# Altium schematic sheet STM32F103最小系统板.SchDoc
size A3
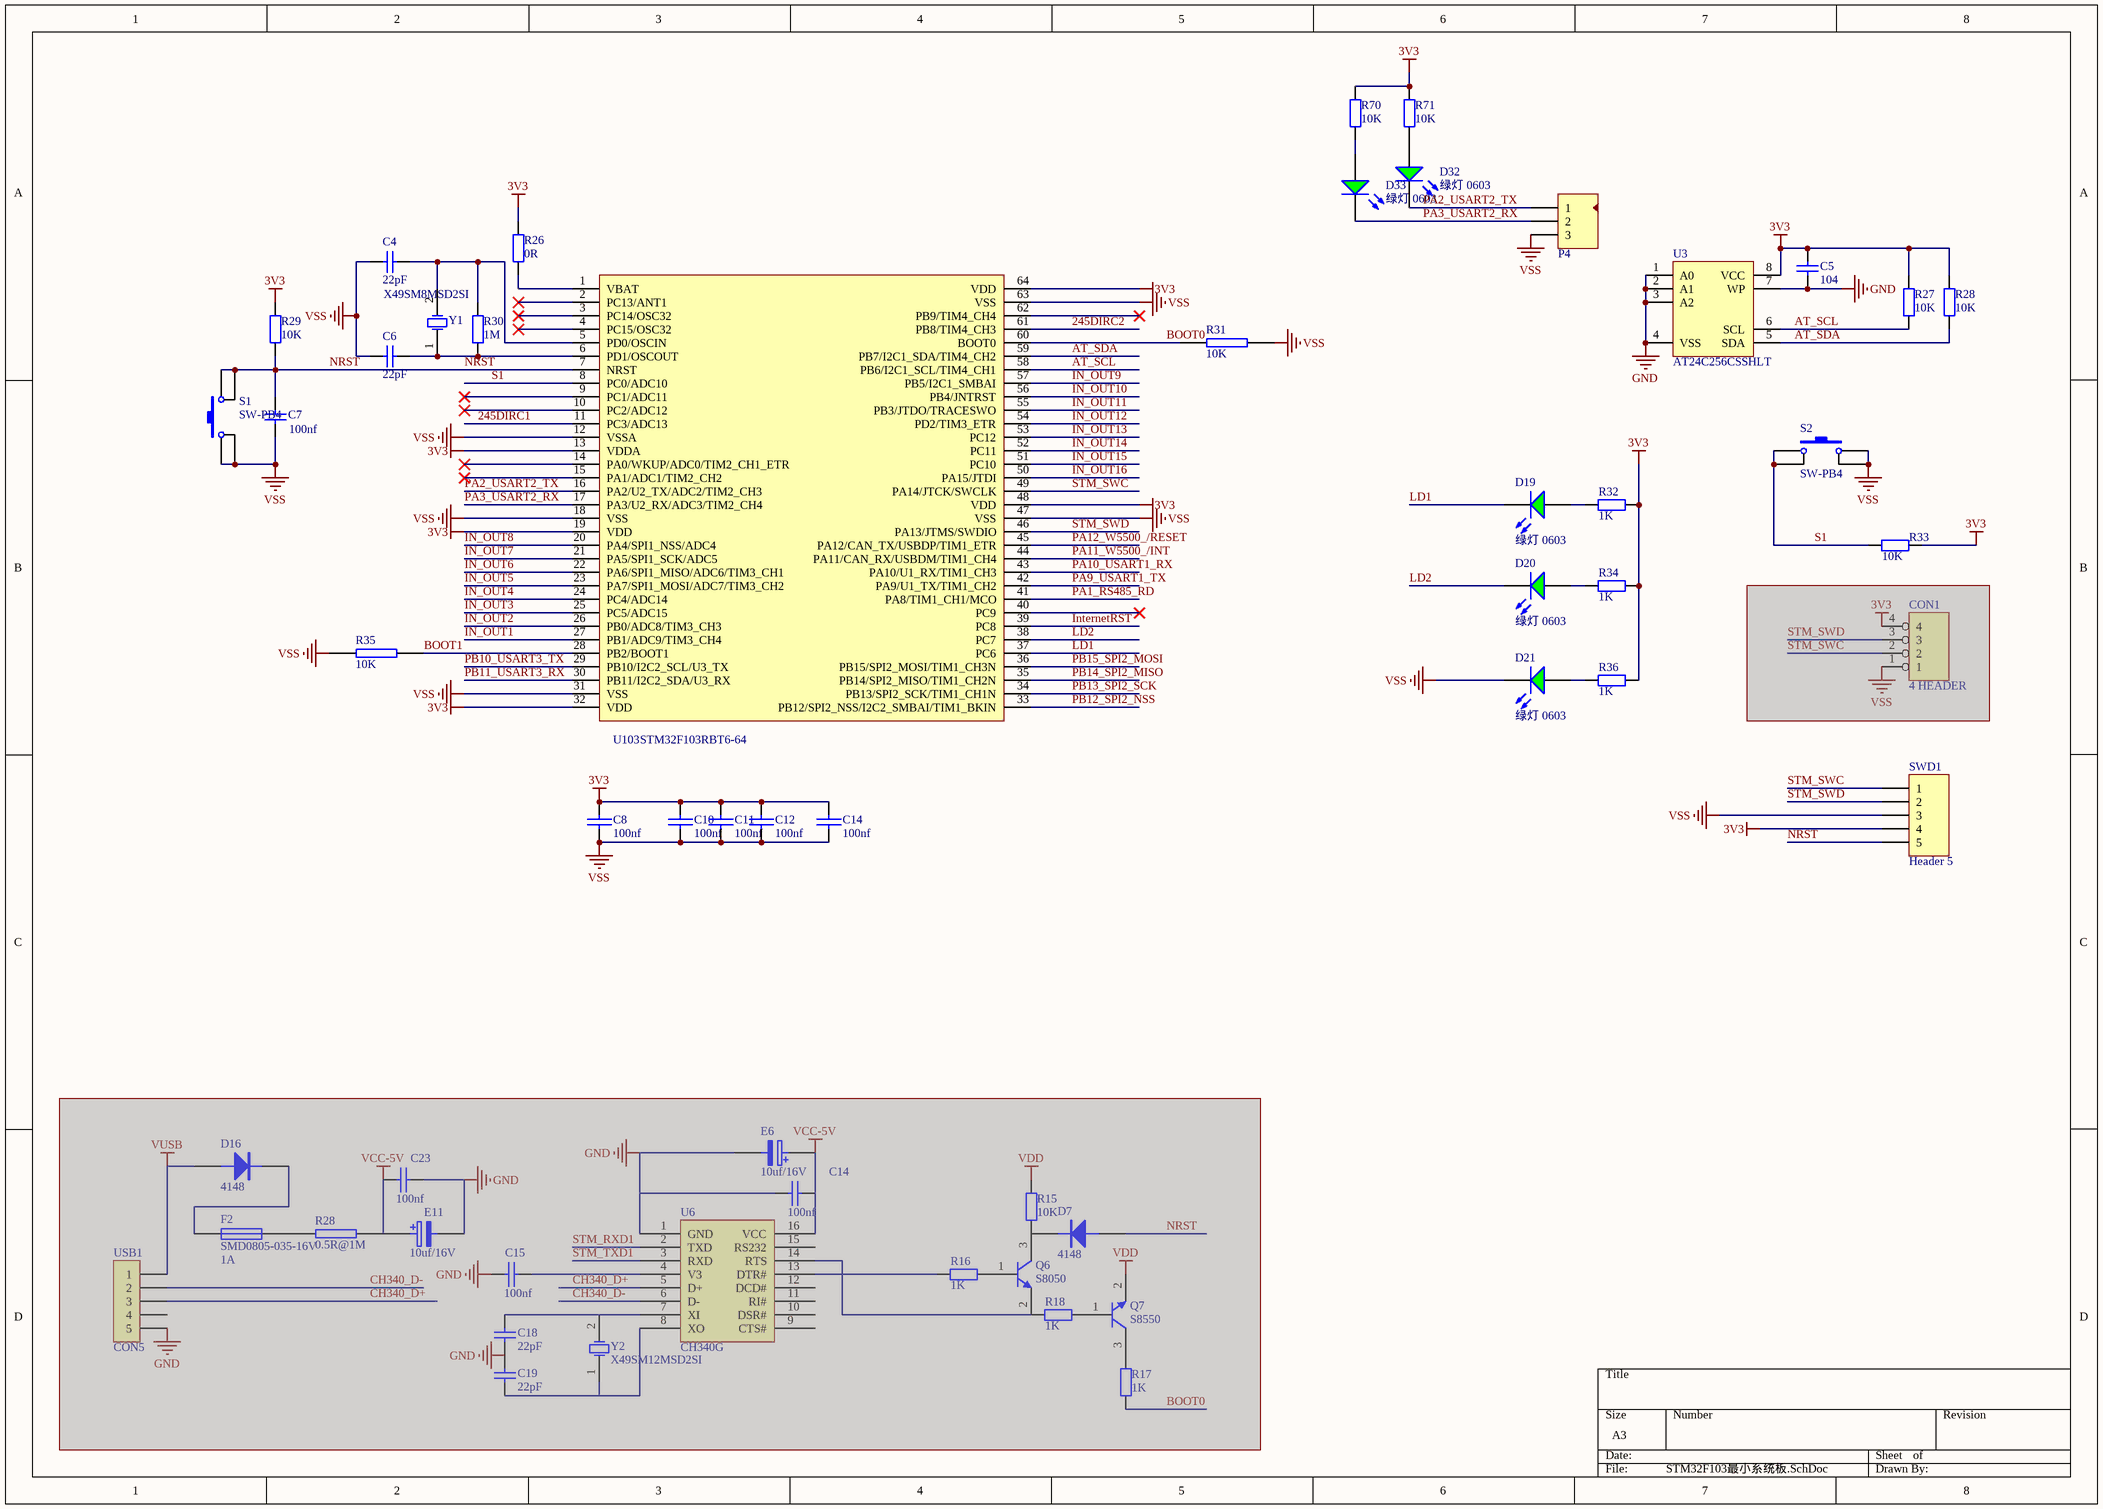
[diagram p0: STM32F103最小系统板.SchDoc]

## Parts
(Parts that share a designator on the sheet are numbered #1, #2 ... from top to bottom, then left to right.)
C4  22pF  [LC-0603_C]
C5  104  [LC-0603_C]
C6  22pF  [LC-0603_C]
C7  100nf  [LC-0603_C]
C8  100nf  [LC-0603_C]
C10  100nf  [LC-0603_C]
C11  100nf  [LC-0603_C]
C12  100nf  [LC-0603_C]
C14#1  100nf  [LC-0603_C]
C14#2  100nf  [LC-0603_C]  (masked out: inside a compile mask, not in the netlist)
C15  100nf  [LC-0603_C]  (masked out: inside a compile mask, not in the netlist)
C18  22pF  [LC-0603_C]  (masked out: inside a compile mask, not in the netlist)
C19  22pF  [LC-0603_C]  (masked out: inside a compile mask, not in the netlist)
C23  100nf  [LC-0603_C]  (masked out: inside a compile mask, not in the netlist)
CON1  4 HEADER  [HDR4X1-2.54]  (masked out: inside a compile mask, not in the netlist)
D7  4148  [LC-LL-34]  (masked out: inside a compile mask, not in the netlist)
D16  4148  [LC-LL-34]  (masked out: inside a compile mask, not in the netlist)
D19  绿灯 0603  [LC-0603_LED_S1]
D20  绿灯 0603  [LC-0603_LED_S1]
D21  绿灯 0603  [LC-0603_LED_S1]
D32  绿灯 0603  [LC-0603_LED_S1]
D33  绿灯 0603  [LC-0603_LED_S1]
E6  10uf/16V  [LC-CASE-A_3216]  (masked out: inside a compile mask, not in the netlist)
E11  10uf/16V  [LC-CASE-A_3216]  (masked out: inside a compile mask, not in the netlist)
F2  SMD0805-035-16V  value 1A  [LC-0805_R]  (masked out: inside a compile mask, not in the netlist)
P4  Header 3  [HDR3X1-2.54]  (value not drawn)
Q6  S8050  [LC-SOT-23(SOT-23-3)]  (masked out: inside a compile mask, not in the netlist)
Q7  S8550  [LC-SOT-23(SOT-23-3)]  (masked out: inside a compile mask, not in the netlist)
R15  10K  [LC-0603_R]  (masked out: inside a compile mask, not in the netlist)
R16  1K  [LC-0603_R]  (masked out: inside a compile mask, not in the netlist)
R17  1K  [LC-0603_R]  (masked out: inside a compile mask, not in the netlist)
R18  1K  [LC-0603_R]  (masked out: inside a compile mask, not in the netlist)
R26  0R  [LC-0603_R]
R27  10K  [LC-0603_R]
R28#1  10K  [LC-0603_R]
R28#2  0.5R@1M  [LC-0805_R]  (masked out: inside a compile mask, not in the netlist)
R29  10K  [LC-0603_R]
R30  1M  [LC-0603_R]
R31  10K  [LC-0603_R]
R32  1K  [0603-1]
R33  10K  [LC-0603_R]
R34  1K  [0603-1]
R35  10K  [LC-0603_R]
R36  1K  [0603-1]
R70  10K  [LC-0603_R]
R71  10K  [LC-0603_R]
S1  SW-PB4  [SW_PB4_A1]
S2  SW-PB4  [SW_PB4_A1]
SWD1  Header 5  [HDR1X5]
U3  AT24C256CSSHLT  [SOIC-8]
U6  CH340G  [LC-SOIC-16_150mil]
U103  STM32F103RBT6-64  [LC-LQFP-64_10x10x05P]
USB1  CON5  [USB_MICRO]  (masked out: inside a compile mask, not in the netlist)
Y1  X49SM8MSD2SI  [LC-HC-49SMD]
Y2  X49SM12MSD2SI  [LC-HC-49SMD]  (masked out: inside a compile mask, not in the netlist)

## Nets
3V3: C5.1 C8.2 C10.2 C11.2 C12.2 C14#1.2 R26.1 R27.1 R28#1.1 R29.2 R32.1 R33.2 R34.1 R36.2 R70.1 R71.1 SWD1.4 U3.8(VCC) U103.13(VDDA) U103.19(VDD) U103.32(VDD) U103.48(VDD) U103.64(VDD)
GND: C5.2 U3.1(A0) U3.2(A1) U3.3(A2) U3.4(VSS) U3.7(WP)
VSS: C4.1 C6.1 C7.1 C8.1 C10.1 C11.1 C12.1 C14#1.1 D21.K P4.3 R31.1 R35.1 S1.1 S1.4 S2.2 S2.3 SWD1.3 U103.12(VSSA) U103.18(VSS) U103.31(VSS) U103.47(VSS) U103.63(VSS)
245DIRC1: U103.11(PC3/ADC13)
245DIRC2: U103.61(PB8/TIM4_CH3)
AT_SCL: R27.2 U3.6(SCL) U103.58(PB6/I2C1_SCL/TIM4_CH1)
AT_SDA: R28#1.2 U3.5(SDA) U103.59(PB7/I2C1_SDA/TIM4_CH2)
BOOT0: R31.2 U103.60(BOOT0)
BOOT1: R35.2 U103.28(PB2/BOOT1)
IN_OUT1: U103.27(PB1/ADC9/TIM3_CH4)
IN_OUT2: U103.26(PB0/ADC8/TIM3_CH3)
IN_OUT3: U103.25(PC5/ADC15)
IN_OUT4: U103.24(PC4/ADC14)
IN_OUT5: U103.23(PA7/SPI1_MOSI/ADC7/TIM3_CH2)
IN_OUT6: U103.22(PA6/SPI1_MISO/ADC6/TIM3_CH1)
IN_OUT7: U103.21(PA5/SPI1_SCK/ADC5)
IN_OUT8: U103.20(PA4/SPI1_NSS/ADC4)
IN_OUT9: U103.57(PB5/I2C1_SMBAI)
IN_OUT10: U103.56(PB4/JNTRST)
IN_OUT11: U103.55(PB3/JTDO/TRACESWO)
IN_OUT12: U103.54(PD2/TIM3_ETR)
IN_OUT13: U103.53(PC12)
IN_OUT14: U103.52(PC11)
IN_OUT15: U103.51(PC10)
IN_OUT16: U103.50(PA15/JTDI)
InternetRST: U103.39(PC8)
LD1: D19.K U103.37(PC6)
LD2: D20.K U103.38(PC7)
NRST: C7.2 R29.1 S1.2 S1.3 SWD1.5 U103.7(NRST)
PA1_RS485_RD: U103.41(PA8/TIM1_CH1/MCO)
PA2_USART2_TX: D32.K P4.1 U103.16(PA2/U2_TX/ADC2/TIM2_CH3)
PA3_USART2_RX: D33.K P4.2 U103.17(PA3/U2_RX/ADC3/TIM2_CH4)
PA9_USART1_TX: U103.42(PA9/U1_TX/TIM1_CH2)
PA10_USART1_RX: U103.43(PA10/U1_RX/TIM1_CH3)
PA11_W5500_/INT: U103.44(PA11/CAN_RX/USBDM/TIM1_CH4)
PA12_W5500_/RESET: U103.45(PA12/CAN_TX/USBDP/TIM1_ETR)
PB10_USART3_TX: U103.29(PB10/I2C2_SCL/U3_TX)
PB11_USART3_RX: U103.30(PB11/I2C2_SDA/U3_RX)
PB12_SPI2_NSS: U103.33(PB12/SPI2_NSS/I2C2_SMBAI/TIM1_BKIN)
PB13_SPI2_SCK: U103.34(PB13/SPI2_SCK/TIM1_CH1N)
PB14_SPI2_MISO: U103.35(PB14/SPI2_MISO/TIM1_CH2N)
PB15_SPI2_MOSI: U103.36(PB15/SPI2_MOSI/TIM1_CH3N)
S1: R33.1 S2.1 S2.4 U103.8(PC0/ADC10)
STM_SWC: SWD1.1 U103.49(PA14/JTCK/SWCLK)
STM_SWD: SWD1.2 U103.46(PA13/JTMS/SWDIO)
NetC4_2: C4.2 R30.2 U103.5(PD0/OSCIN) Y1.2(OSC2)
NetC6_2: C6.2 R30.1 U103.6(PD1/OSCOUT) Y1.1(OSC1)
NetD19_A: D19.A R32.2
NetD20_A: D20.A R34.2
NetD21_A: D21.A R36.1
NetD32_A: D32.A R71.2
NetD33_A: D33.A R70.2
NetR26_2: R26.2 U103.1(VBAT)

Not connected (* = marked no-connect by the designer): U6 1(GND) 2(TXD) 3(RXD) 4(V3) 5(D+) 6(D-) 7(XI) 8(XO) 9(CTS#) 10(DSR#) 11(RI#) 12(DCD#) 13(DTR#) 14(RTS) 15(RS232) 16(VCC); U103 2(PC13/ANT1)* 3(PC14/OSC32)* 4(PC15/OSC32)* 9(PC1/ADC11)* 10(PC2/ADC12)* 14(PA0/WKUP/ADC0/TIM2_CH1_ETR)* 15(PA1/ADC1/TIM2_CH2)* 40(PC9)* 62(PB9/TIM4_CH4)*

## Library data of the parts
C4 C6 C18 C19 = Cap: Capacitor; Published: 8-Jun-2000; LatestRevisionDate: 17-Jul-2002; LatestRevisionNote: Re-released for DXP Platform.; PackageReference: RAD-0.3; Publisher: Altium Limited; Value: 22pF
C5 = CAP: Capacitor; Value: 100nF; Published: 8-Jun-2000; Revision: July-2002: Re-released for DXP Platform.; Publisher: Altium Limited
C7 = Cap: Capacitor; Value: 0.1uF; Published: 8-Jun-2000; LatestRevisionDate: 17-Jul-2002; LatestRevisionNote: Re-released for DXP Platform.; PackageReference: RAD-0.3; Publisher: Altium Limited
C8 C10-C12 C14#1 C14#2 C15 C23 = CAP: Capacitor
CON1 = 4 HEADER: 4 Pin Header
D7 D16 = DIODE
D19-D21 D32 D33 = 0603 绿灯: 发光二极管; ComponentLink1Description: 供应商链接; ComponentLink1URL: http://www.szlcsc.com/product/details_73152.html; Package: 0603; Supplier: LC; SuppliersPartNumber: C72043
E6 E11 = ELECTRO2: Electrolytic Capacitor
F2 = Fuse1: 保险丝
P4 = Header 3: 接插件; LatestRevisionDate: 17-Jul-2002; LatestRevisionNote: Re-released for DXP Platform.; Publisher: Altium Limited
Q7 = S8050
R15 R27 R28#1 R29 R70 R71 = Res2: Resistor; Published: 8-Jun-2000; LatestRevisionDate: 17-Jul-2002; LatestRevisionNote: Re-released for DXP Platform.; PackageReference: AXIAL-0.4; Publisher: Altium Limited; Value: 10K
R16-R18 R26 R30 = Res2: Resistor; Value: 10K; Published: 8-Jun-2000; LatestRevisionDate: 17-Jul-2002; LatestRevisionNote: Re-released for DXP Platform.; PackageReference: AXIAL-0.4; Publisher: Altium Limited
R28#2 R31 R35 = RES2
R32-R34 R36 = R: 贴片电阻; Published: 8-Jun-2000; LatestRevisionDate: 17-Jul-2002; LatestRevisionNote: Re-released for DXP Platform.; PackageReference: AXIAL-0.4; Publisher: Altium Limited
  R32 R34 R36: Value: 1K
  R33: Value: 10K
S1 S2 = SW-: 微动开关; Published: 24-Mar-1999; LatestRevisionDate: 17-Jul-2002; LatestRevisionNote: Re-released for DXP Platform.; PackageReference: SPST-2; Publisher: Altium Limited
SWD1 = Header 5: Header, 5-Pin; LatestRevisionDate: 17-Jul-2002; LatestRevisionNote: Re-released for DXP Platform.; Publisher: Altium Limited
U3 = AT2: EEROM存储器
U103 = STM32F103RBT6
USB1 = CON5: Connector
Y1 Y2 = XTAL: Crystal Oscillator; Published: 8-Jun-2000; LatestRevisionDate: 17-Jul-2002; LatestRevisionNote: Re-released for DXP Platform.; PackageReference: R38; Publisher: Altium Limited